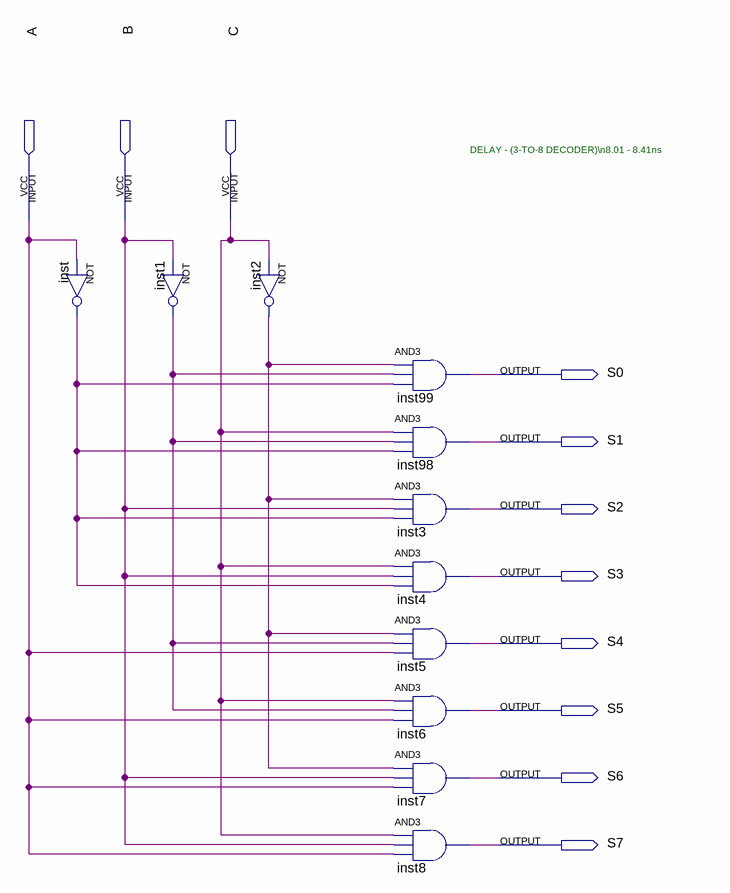
[diagram p0: schematic sheet]
// Quartus schematic DECODER3_8.bdf as structural Verilog: 11 symbols, 11 pins
module DECODER3_8 (
  input  A,
  input  B,
  input  C,
  output S0,
  output S1,
  output S2,
  output S3,
  output S4,
  output S5,
  output S6,
  output S7
);

  wire inst1_out, inst2_out, inst_out;

  not inst (inst_out, A);
  not inst1 (inst1_out, B);
  not inst2 (inst2_out, C);
  and inst99 (S0, inst2_out, inst1_out, inst_out);
  and inst98 (S1, C, inst1_out, inst_out);
  and inst3 (S2, inst2_out, B, inst_out);
  and inst4 (S3, C, B, inst_out);
  and inst5 (S4, inst2_out, inst1_out, A);
  and inst6 (S5, C, inst1_out, A);
  and inst7 (S6, inst2_out, B, A);
  and inst8 (S7, C, B, A);

  // Notes on the sheet:
  //   DELAY - (3-TO-8 DECODER)\n8.01 - 8.41ns
endmodule
